# EAGLE design edu_brain (EAGLE 8.5.0)
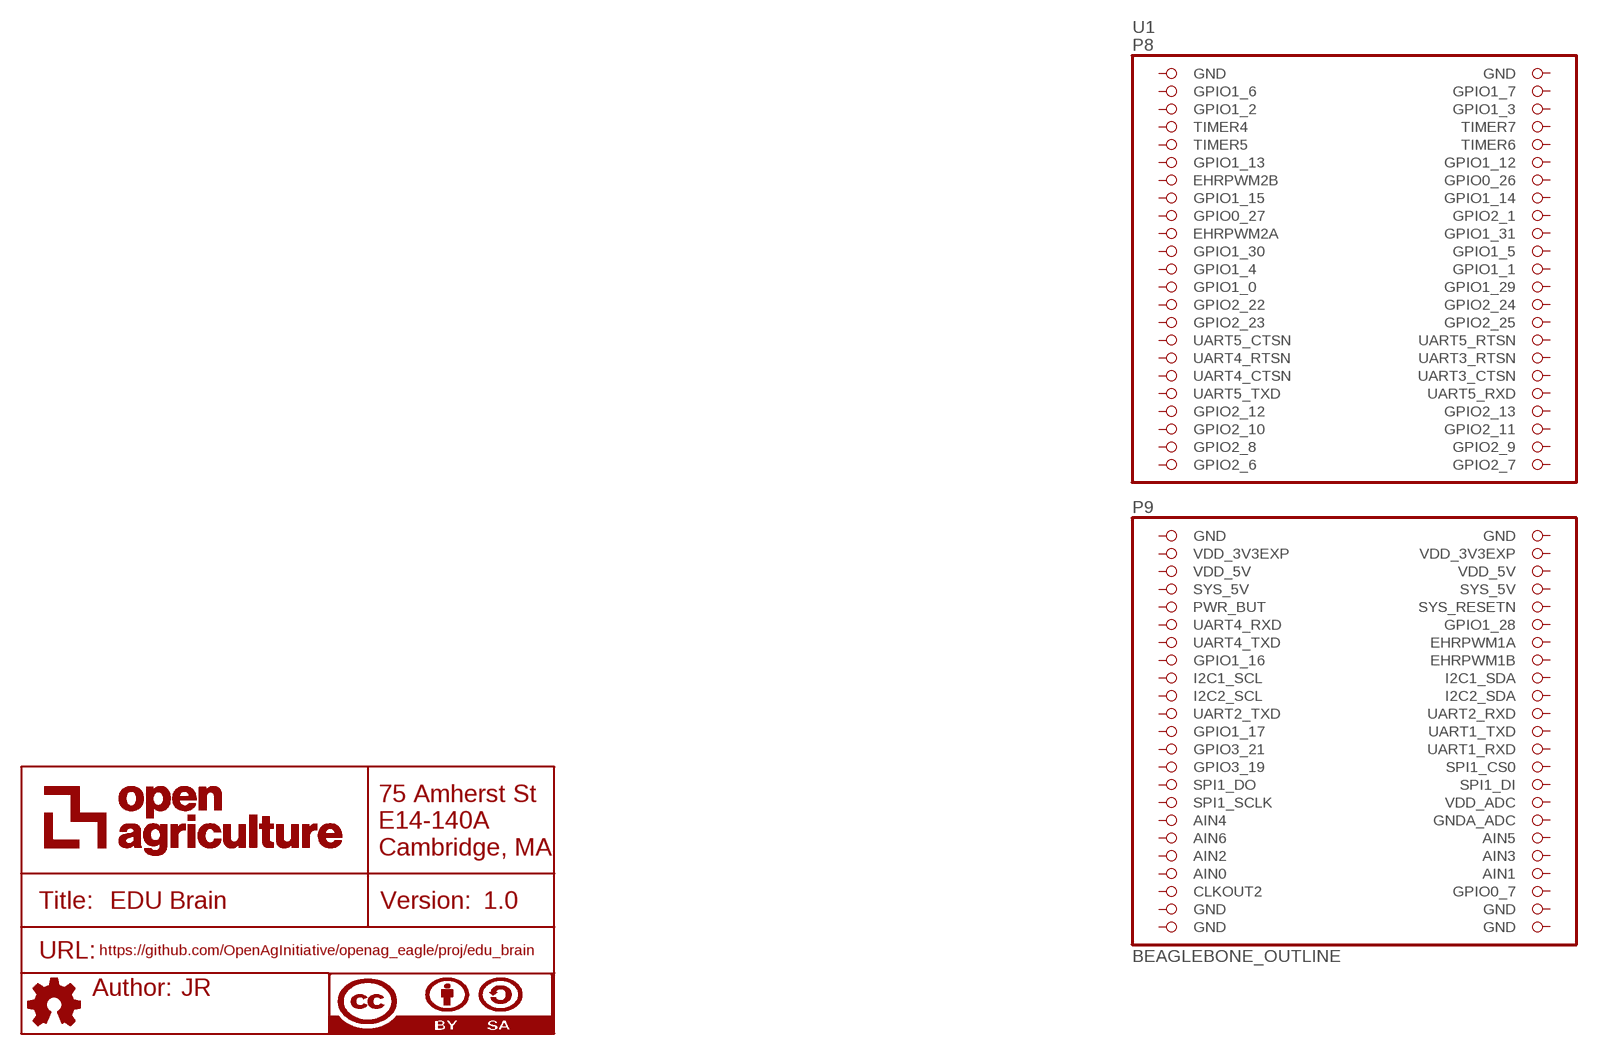
[diagram p0: schematic, sheet 1]

## Parts
FRAME1  DOCFIELD  [DOCFIELD]
U1  BEAGLEBONE_OUTLINE  [BEAGLEBONE_SHIELD]
Unconnected: U1.3(GPIO1_6) U1.4(GPIO1_7) U1.5(GPIO1_2) U1.6(GPIO1_3) U1.7(TIMER4) U1.8(TIMER7) U1.9(TIMER5) U1.10(TIMER6) U1.11(GPIO1_13) U1.12(GPIO1_12) U1.13(EHRPWM2B) U1.14(GPIO0_26) U1.15(GPIO1_15) U1.16(GPIO1_14) U1.17(GPIO0_27) U1.18(GPIO2_1) U1.19(EHRPWM2A) U1.20(GPIO1_31) U1.21(GPIO1_30) U1.22(GPIO1_5) U1.23(GPIO1_4) U1.24(GPIO1_1) U1.25(GPIO1_0) U1.26(GPIO1_29) U1.27(GPIO2_22) U1.28(GPIO2_24) U1.29(GPIO2_23) U1.30(GPIO2_25) U1.31(UART5_CTSN) U1.32(UART5_RTSN) U1.33(UART4_RTSN) U1.34(UART3_RTSN) U1.35(UART4_CTSN) U1.36(UART3_CTSN) U1.37(UART5_TXD) U1.38(UART5_RXD) U1.39(GPIO2_12) U1.40(GPIO2_13) U1.41(GPIO2_10) U1.42(GPIO2_11) U1.43(GPIO2_8) U1.44(GPIO2_9) U1.45(GPIO2_6) U1.46(GPIO2_7) U1.54(SYS_5V) U1.55(PWR_BUT) U1.56(SYS_RESETN) U1.57(UART4_RXD) U1.58(GPIO1_28) U1.59(UART4_TXD) U1.60(EHRPWM1A) U1.61(GPIO1_16) U1.62(EHRPWM1B) U1.63(I2C1_SCL) U1.64(I2C1_SDA) U1.65(I2C2_SCL) U1.66(I2C2_SDA) U1.67(UART2_TXD) U1.68(UART2_RXD) U1.69(GPIO1_17) U1.70(UART1_TXD) U1.71(GPIO3_21) U1.72(UART1_RXD) U1.73(GPIO3_19) U1.74(SPI1_CS0) U1.75(SPI1_DO) U1.76(SPI1_DI) U1.77(SPI1_SCLK) U1.78(VDD_ADC) U1.79(AIN4) U1.80(GNDA_ADC) U1.81(AIN6) U1.82(AIN5) U1.83(AIN2) U1.84(AIN3) U1.86(AIN1) U1.87(CLKOUT2) U1.88(GPIO0_7)

## Power pins joined to a net without a drawn wire
AIN0: U1.85(AIN0)
GND: U1.1(GND) U1.2(GND) U1.47(GND) U1.48(GND) U1.89(GND) U1.90(GND) U1.91(GND) U1.92(GND)
SYS_5V: U1.53(SYS_5V)
VDD_3V3EXP: U1.49(VDD_3V3EXP) U1.50(VDD_3V3EXP)
VDD_5V: U1.51(VDD_5V) U1.52(VDD_5V)

## Library data of the parts
FRAME1 = openag-frames:DOCFIELD: DOCUMENT FIELD; AUTHOR: JR; DESCRIPTION: Top Brain for PFC-EDU; TITLE: EDU Brain; URL: https://github.com/OpenAgInitiative/openag_eagle/proj/edu_brain; VER: 1.0
U1 = openag-microcontrollers:BEAGLEBONE_OUTLINE: Should match A3 pinout - but not completely tested

## Board
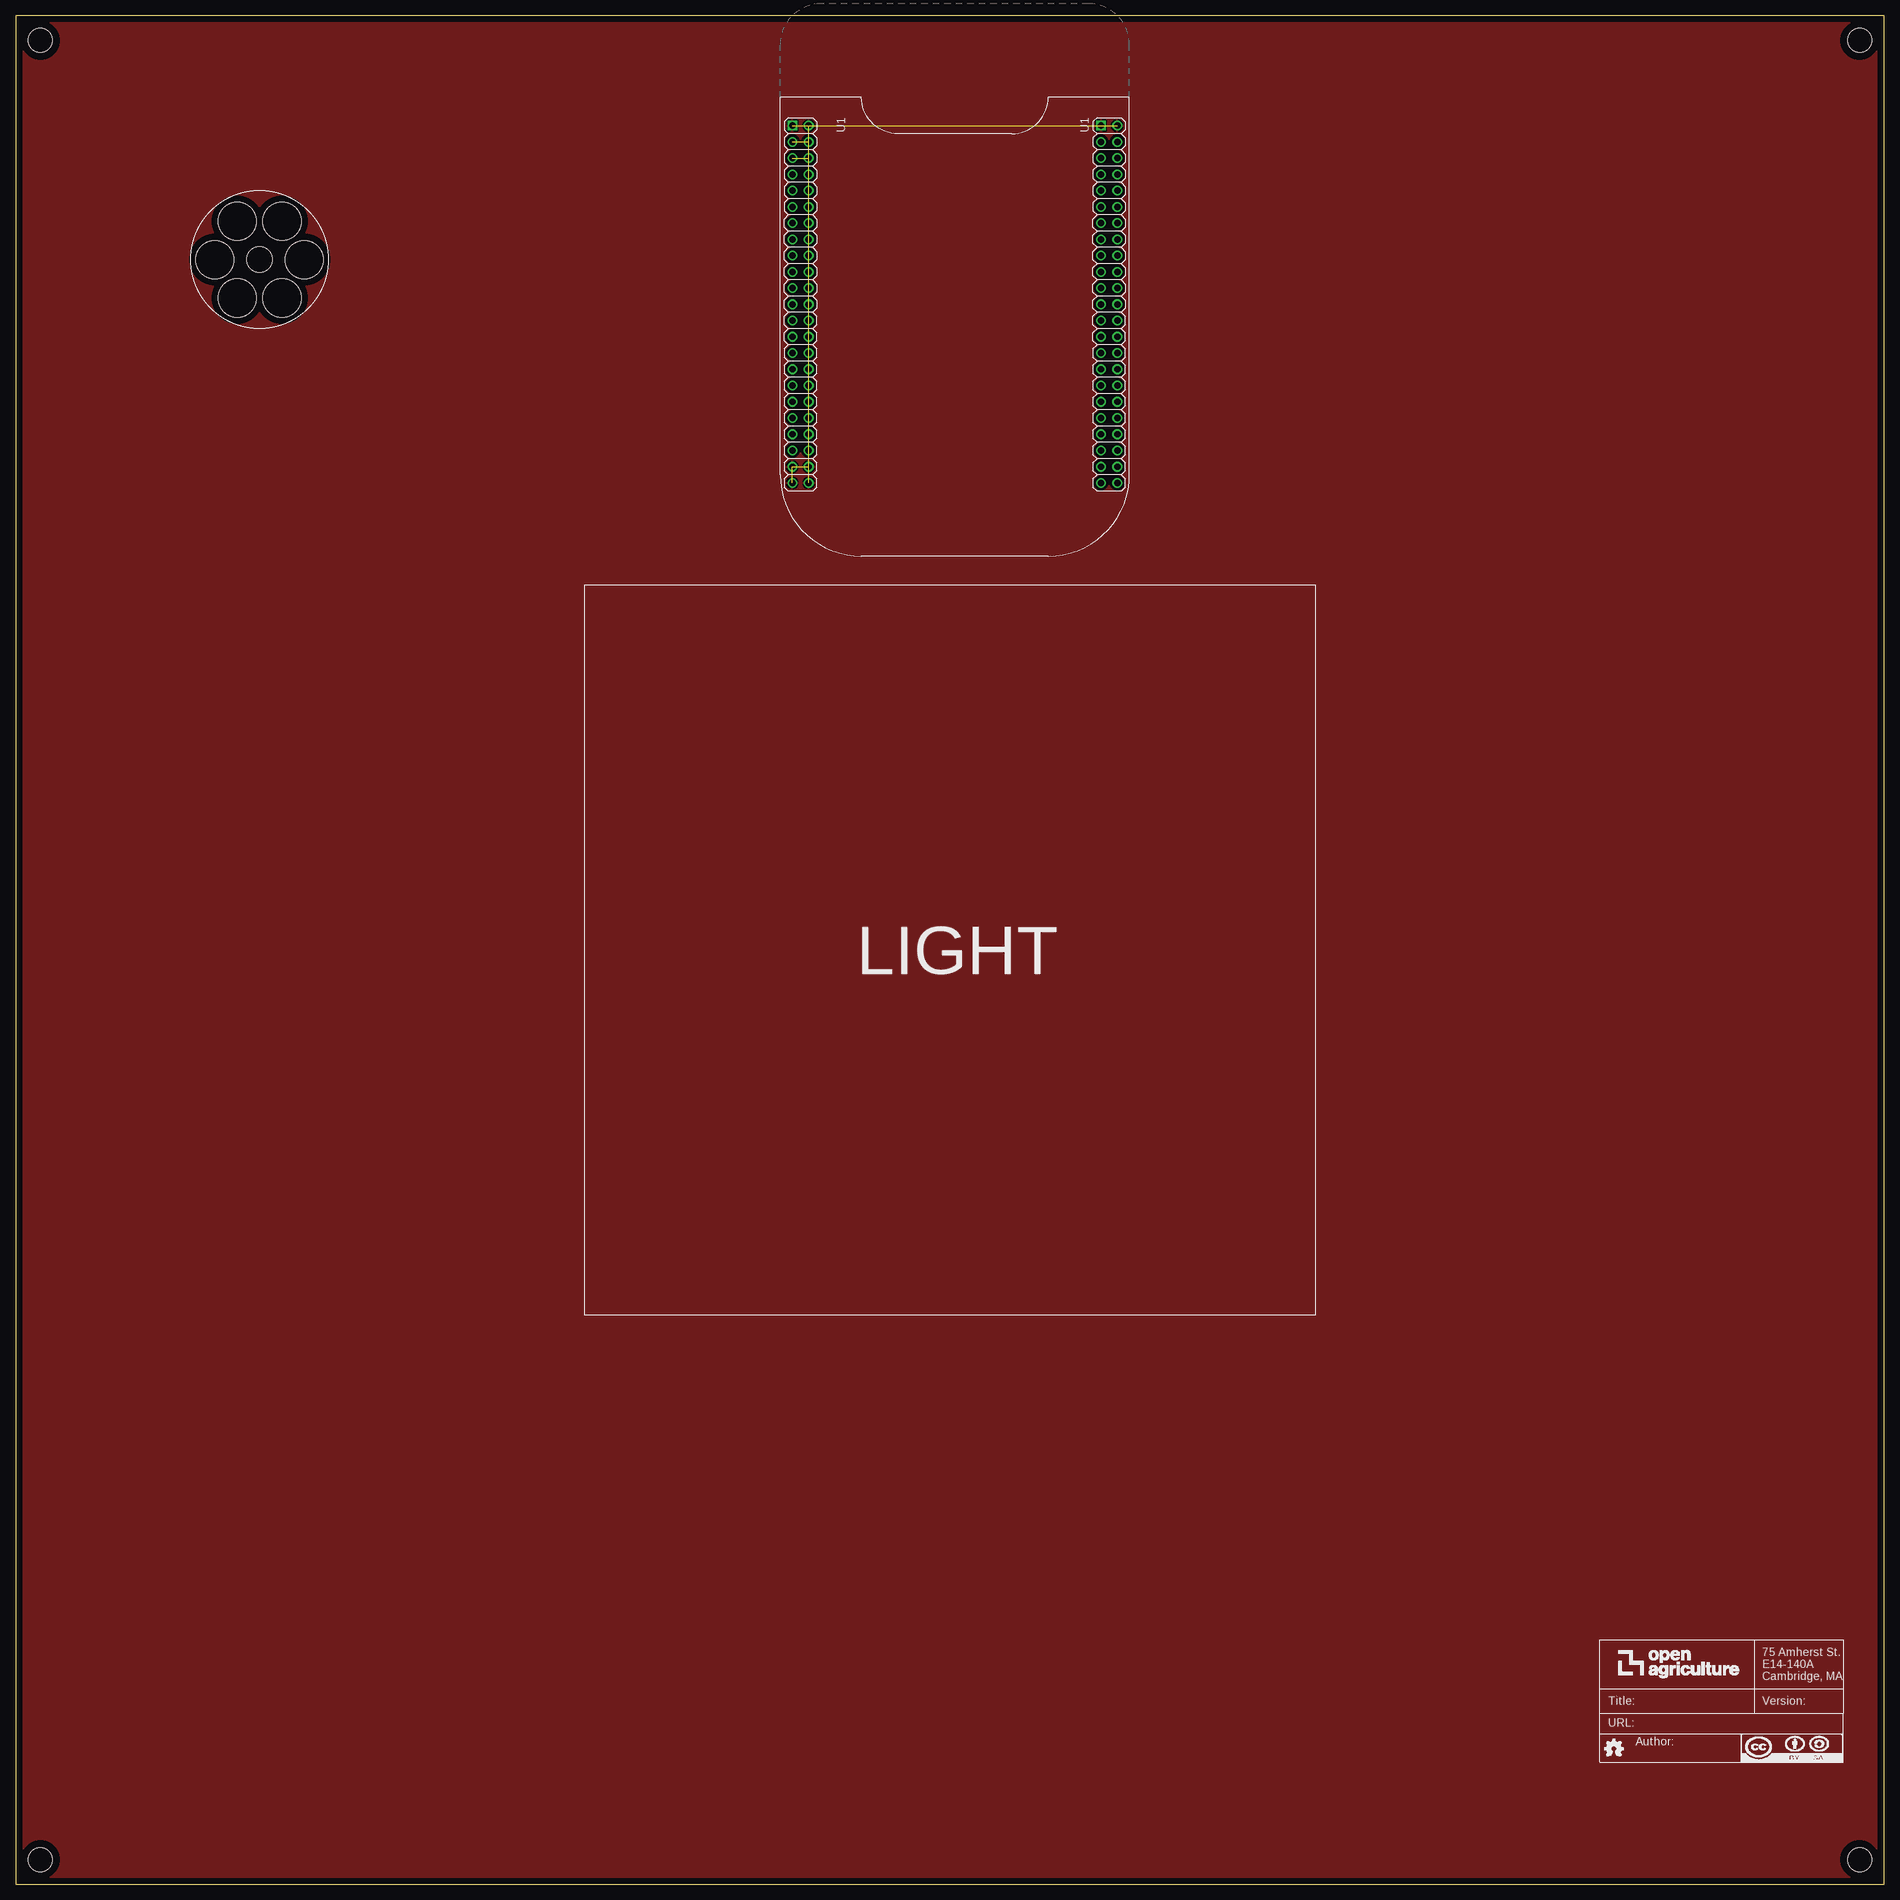
[diagram p1: board, top side]
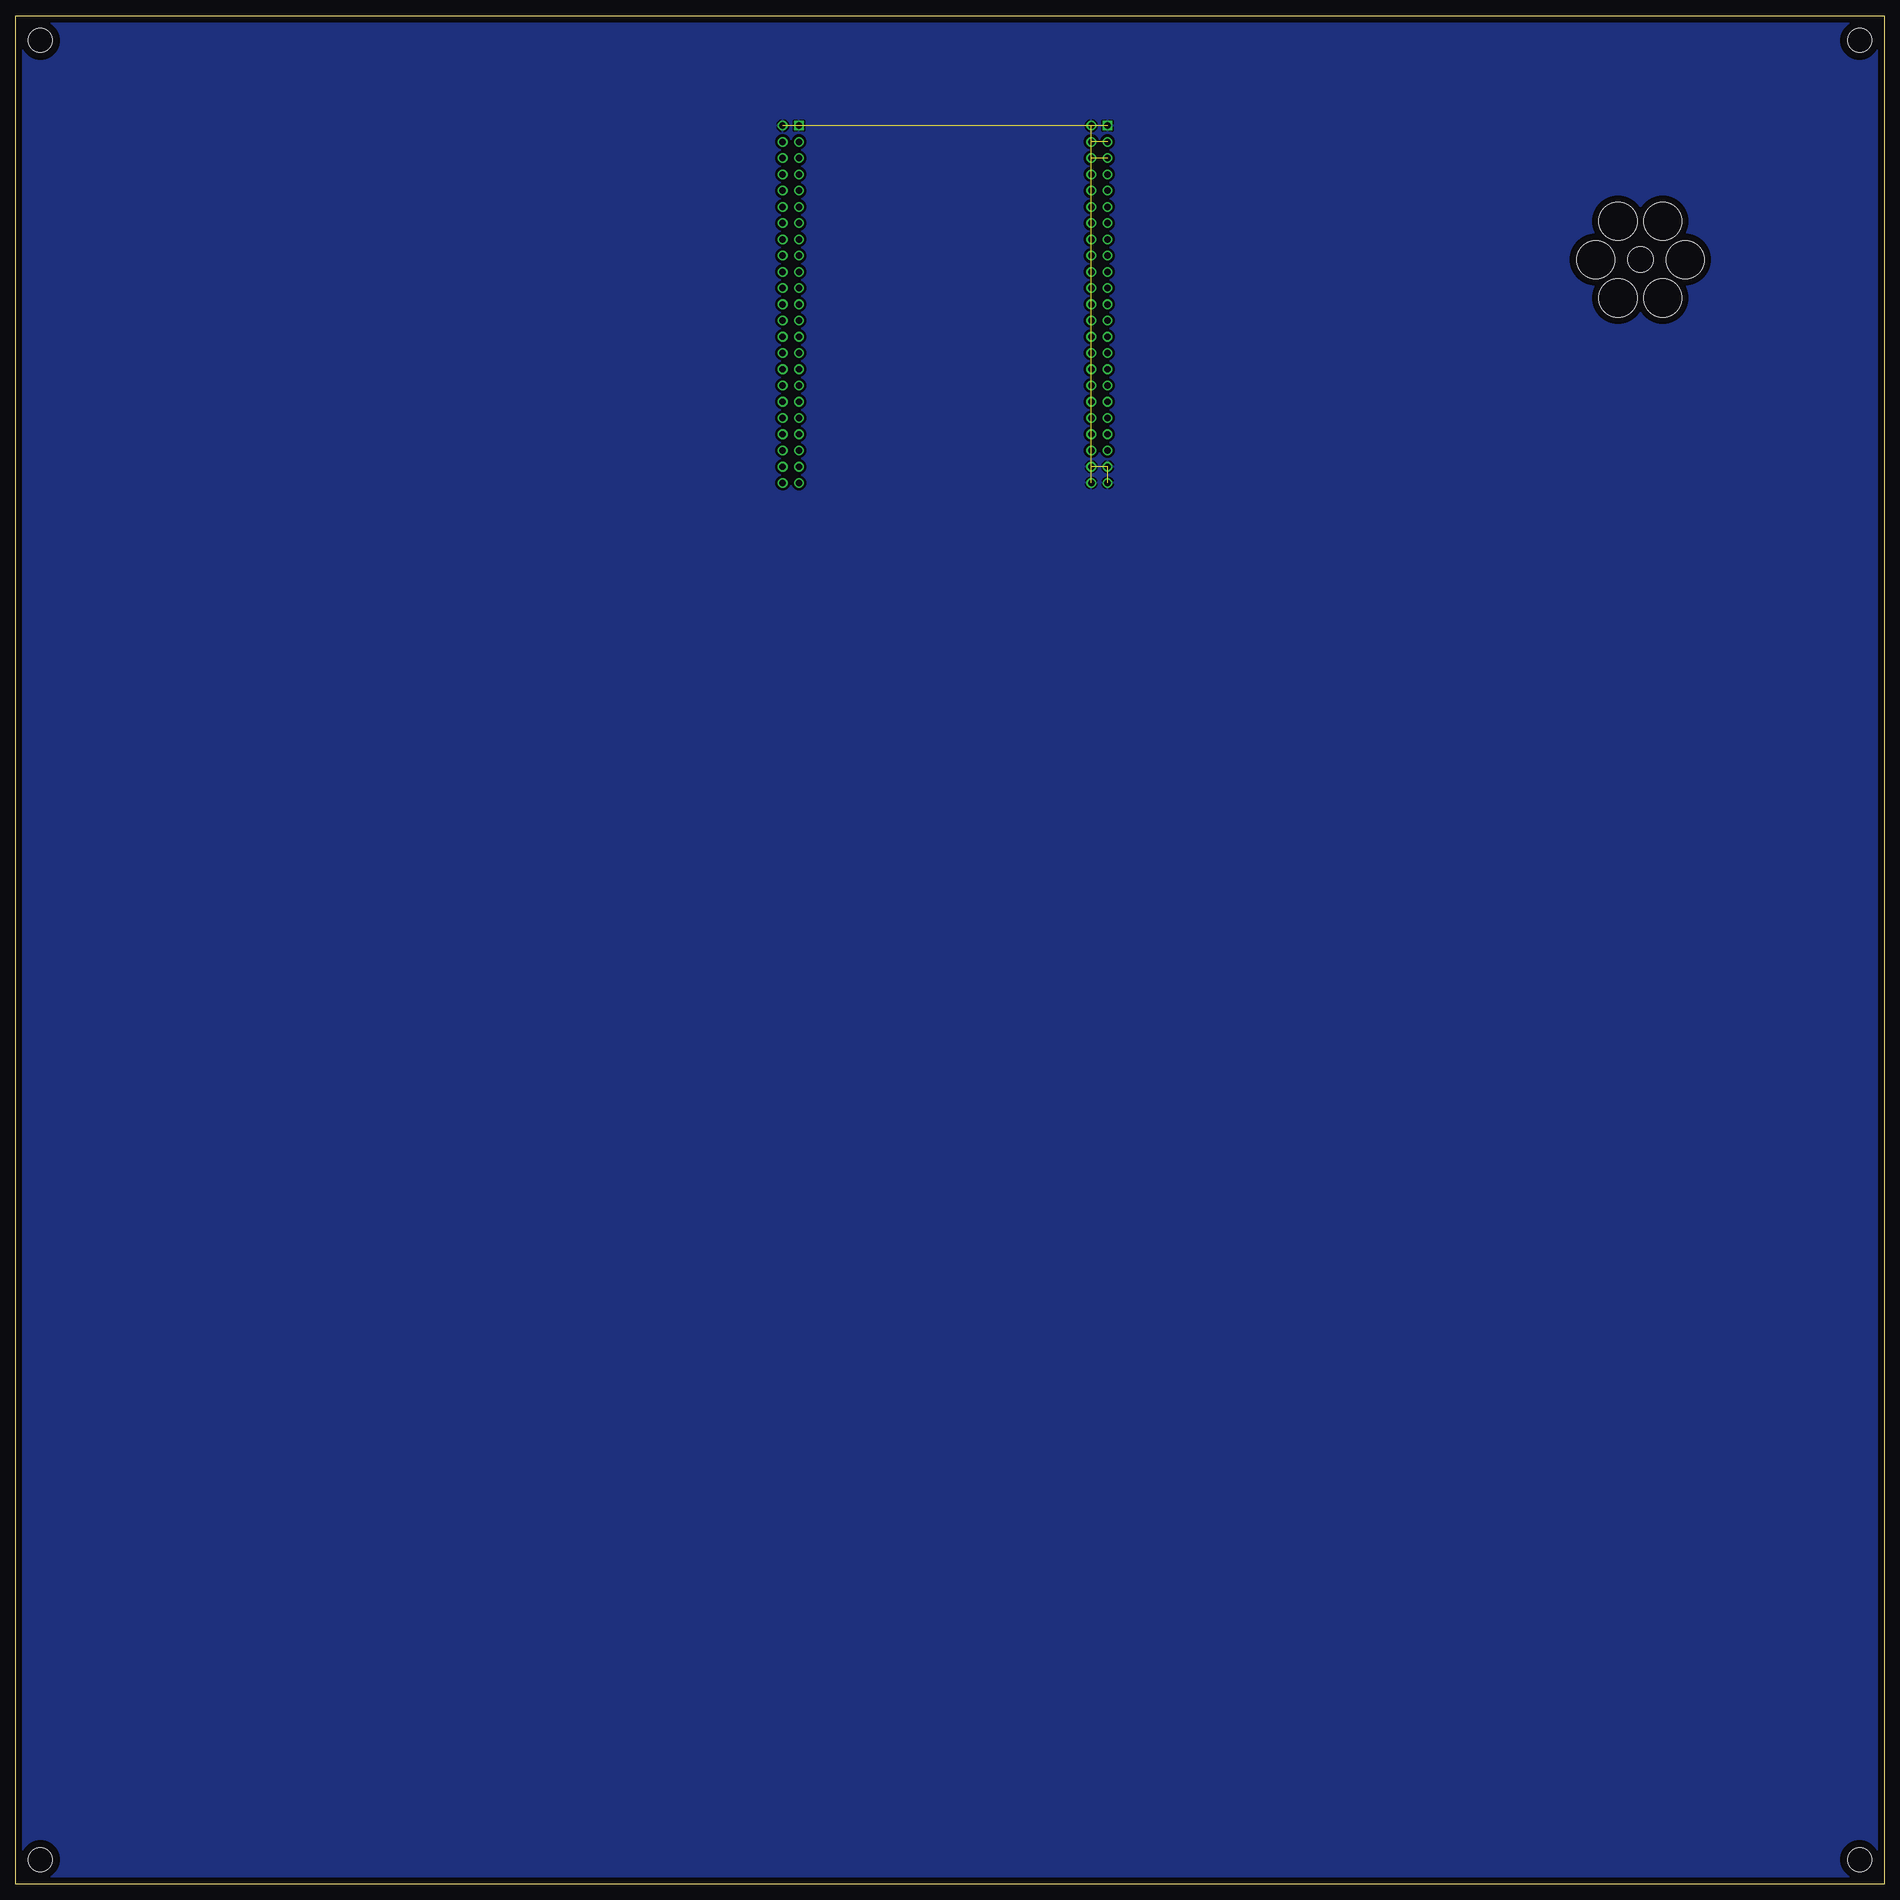
[diagram p2: board, bottom side, seen from below]

Size 292.1 x 292.1 mm. Coordinates in mm from the lower left corner, seen from the top.
Outline: 0,0 292.1,0 292.1,292.1 0,292.1 0,0
Copper layers (1*16): Top 0.035mm / dielectric 1.5mm / Bottom 0.035mm
Design rules "default": minimum track width 6mil, minimum drill 0.35mm, track to track 6mil, track to pad 6mil, pad to pad 6mil, via to via 6mil, smd to smd 6mil, copper to edge 40mil, drill to drill 6mil, minimum pad ring 10mil, minimum via ring 8mil, stop-mask expansion 4mil, vias tented up to drill 0mil, thermal gap 10mil

### Footprints (pad centres in the part's own frame; a part is rotated, then mirrored left to right if it is on the bottom)
BEAGLEBONE_SHIELD = drill 1 square: 1 4.445,19.05; 47 52.705,19.05 | drill 1: 2 1.905,19.05; 3 4.445,21.59; 4 1.905,21.59; 5 4.445,24.13; 6 1.905,24.13; 7 4.445,26.67; 8 1.905,26.67; 9 4.445,29.21; 10 1.905,29.21; 11 4.445,31.75; 12 1.905,31.75; 13 4.445,34.29; 14 1.905,34.29; 15 4.445,36.83; 16 1.905,36.83; 17 4.445,39.37; 18 1.905,39.37; 19 4.445,41.91; 20 1.905,41.91; 21 4.445,44.45; 22 1.905,44.45; 23 4.445,46.99; 24 1.905,46.99; 25 4.445,49.53; 26 1.905,49.53; 27 4.445,52.07; 28 1.905,52.07; 29 4.445,54.61; 30 1.905,54.61; 31 4.445,57.15; 32 1.905,57.15; 33 4.445,59.69; 34 1.905,59.69; 35 4.445,62.23; 36 1.905,62.23; 37 4.445,64.77; 38 1.905,64.77; 39 4.445,67.31; 40 1.905,67.31; 41 4.445,69.85; 42 1.905,69.85; 43 4.445,72.39; 44 1.905,72.39; 45 4.445,74.93; 46 1.905,74.93; 48 50.165,19.05; 49 52.705,21.59; 50 50.165,21.59; 51 52.705,24.13; 52 50.165,24.13; 53 52.705,26.67; 54 50.165,26.67; 55 52.705,29.21; 56 50.165,29.21; 57 52.705,31.75; 58 50.165,31.75; 59 52.705,34.29; 60 50.165,34.29; 61 52.705,36.83; 62 50.165,36.83; 63 52.705,39.37; 64 50.165,39.37; 65 52.705,41.91; 66 50.165,41.91; 67 52.705,44.45; 68 50.165,44.45; 69 52.705,46.99; 70 50.165,46.99; 71 52.705,49.53; 72 50.165,49.53; 73 52.705,52.07; 74 50.165,52.07; 75 52.705,54.61; 76 50.165,54.61; 77 52.705,57.15; 78 50.165,57.15; 79 52.705,59.69; 80 50.165,59.69; 81 52.705,62.23; 82 50.165,62.23; 83 52.705,64.77; 84 50.165,64.77; 85 52.705,67.31; 86 50.165,67.31; 87 52.705,69.85; 88 50.165,69.85; 89 52.705,72.39; 90 50.165,72.39; 91 52.705,74.93; 92 50.165,74.93
OPENAG-CORNER-MOUNTING-HOLE = hole 3.81: 0,0
UMBRELLA-VALVE-21.5MM = hole 6: -7,0; 7,0; -3.5,6; 3.5,6; -3.5,-6; 3.5,-6 | hole 4: 0,0

### Placement (x,y rotation side)
FRAME1  247.65,19.05 0 top
U1  174.12,294 180 top
U$1  [OPENAG-CORNER-MOUNTING-HOLE]  3.81,3.81 0 top
U$2  [OPENAG-CORNER-MOUNTING-HOLE]  3.81,288.29 270 top
U$3  [OPENAG-CORNER-MOUNTING-HOLE]  288.29,288.29 180 top
U$4  [OPENAG-CORNER-MOUNTING-HOLE]  288.29,3.81 90 top
U$5  [UMBRELLA-VALVE-21.5MM]  38.1,254 0 top

### Tracks (layer width: path | path; a pad name or v marks a point on that pad's centre or on a via)
GND  (7 unrouted)
  pour Top (isolate 0.406, rank 3): 0,0 292.1,0 292.1,292.1 0,292.1
  pour Bottom (isolate 0.406, rank 3): 0,292.1 292.1,292.1 292.1,0 0,0
VDD_3V3EXP  (1 unrouted)
VDD_5V  (1 unrouted)

### Text on the board
tPlace: LIGHT